# EAGLE schematic Lixieuhr_Master (EAGLE 7.7.0)
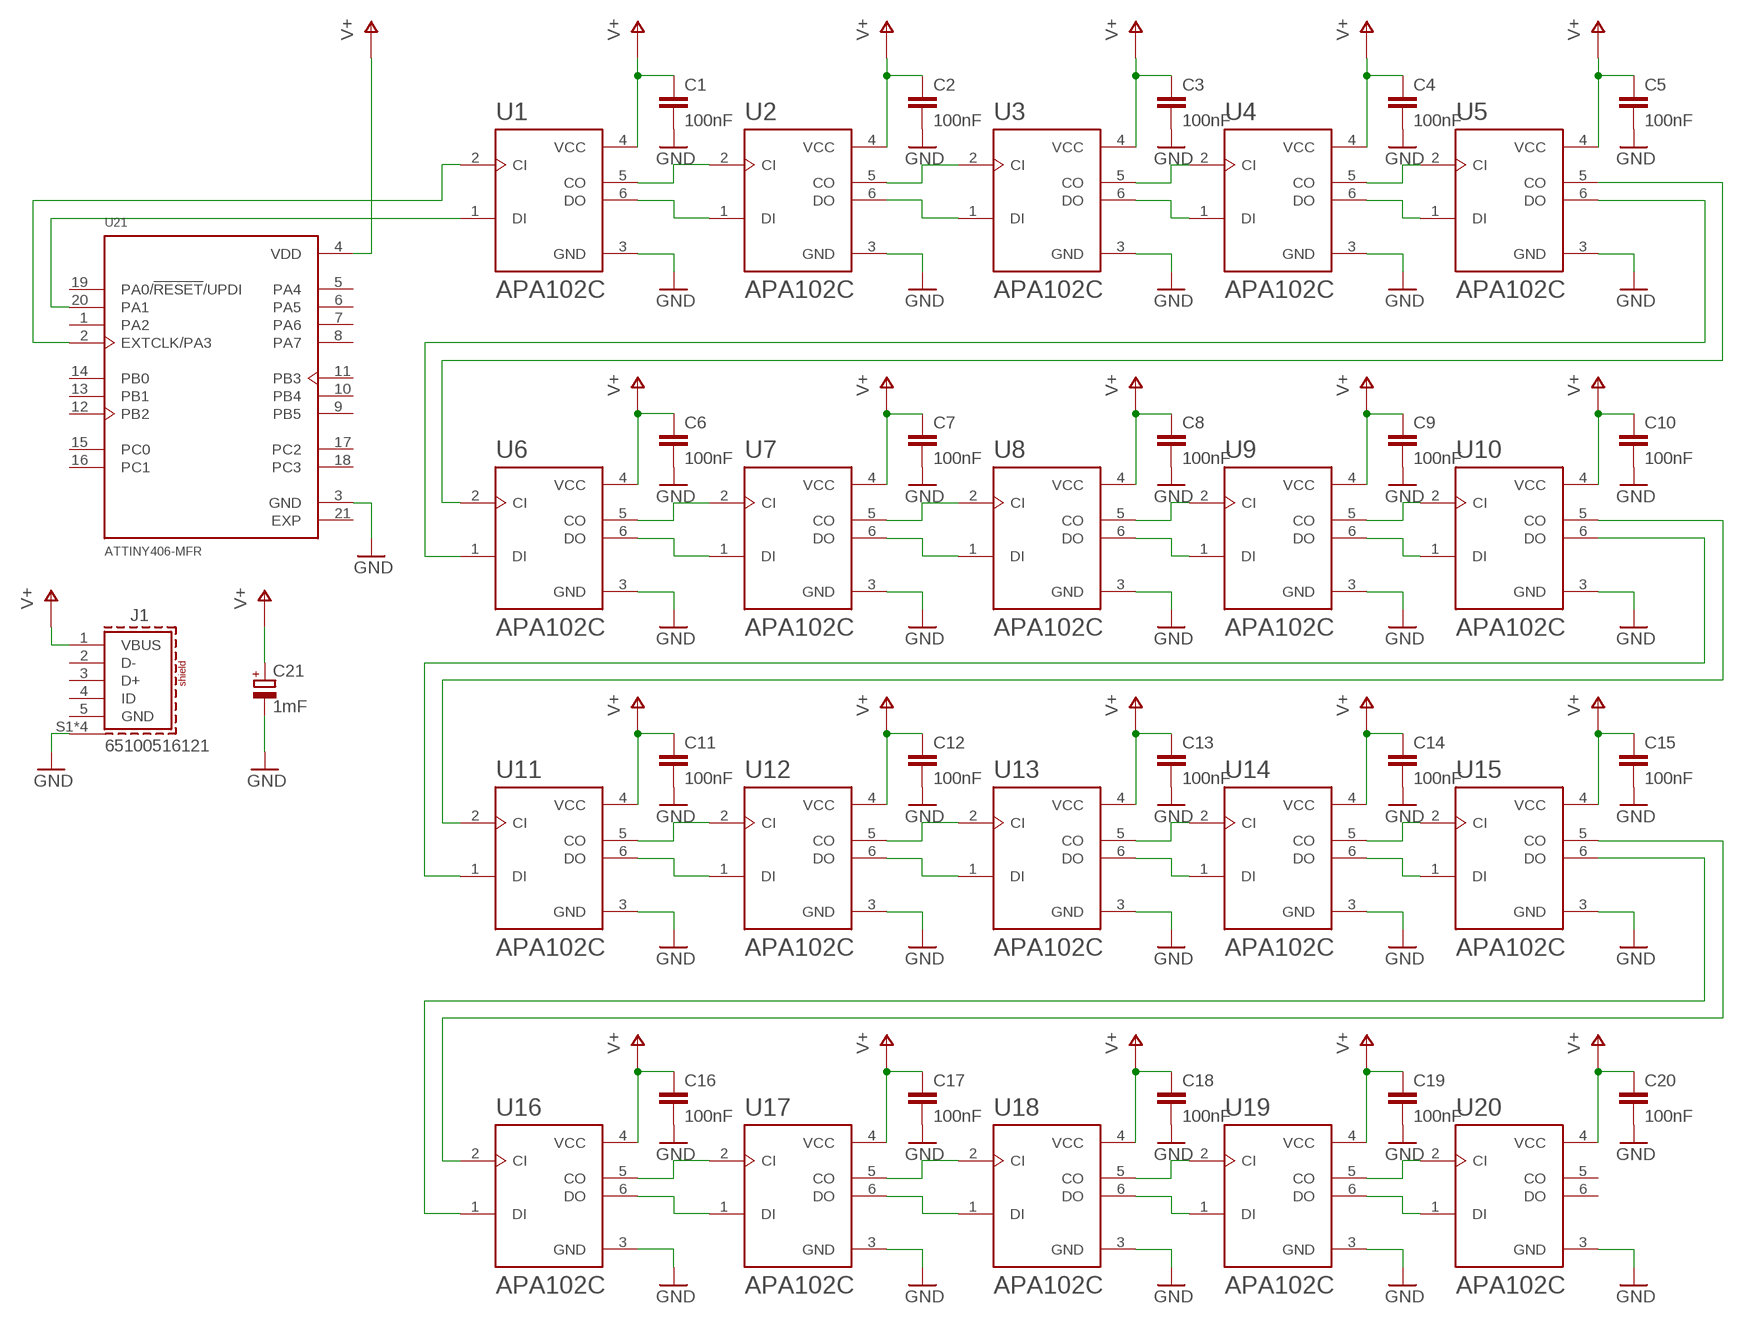
[diagram p0: schematic, sheet 1]

## Parts
C1  100nF  C-0805  [C0805]
C2  100nF  C-0805  [C0805]
C3  100nF  C-0805  [C0805]
C4  100nF  C-0805  [C0805]
C5  100nF  C-0805  [C0805]
C6  100nF  C-0805  [C0805]
C7  100nF  C-0805  [C0805]
C8  100nF  C-0805  [C0805]
C9  100nF  C-0805  [C0805]
C10  100nF  C-0805  [C0805]
C11  100nF  C-0805  [C0805]
C12  100nF  C-0805  [C0805]
C13  100nF  C-0805  [C0805]
C14  100nF  C-0805  [C0805]
C15  100nF  C-0805  [C0805]
C16  100nF  C-0805  [C0805]
C17  100nF  C-0805  [C0805]
C18  100nF  C-0805  [C0805]
C19  100nF  C-0805  [C0805]
C20  100nF  C-0805  [C0805]
C21  1mF  CPOL-EUE5-8.5  [E5-8,5]
J1  65100516121  [65100516121]
U1  APA102C  [SON160P500X500X140-6N]
U2  APA102C  [SON160P500X500X140-6N]
U3  APA102C  [SON160P500X500X140-6N]
U4  APA102C  [SON160P500X500X140-6N]
U5  APA102C  [SON160P500X500X140-6N]
U6  APA102C  [SON160P500X500X140-6N]
U7  APA102C  [SON160P500X500X140-6N]
U8  APA102C  [SON160P500X500X140-6N]
U9  APA102C  [SON160P500X500X140-6N]
U10  APA102C  [SON160P500X500X140-6N]
U11  APA102C  [SON160P500X500X140-6N]
U12  APA102C  [SON160P500X500X140-6N]
U13  APA102C  [SON160P500X500X140-6N]
U14  APA102C  [SON160P500X500X140-6N]
U15  APA102C  [SON160P500X500X140-6N]
U16  APA102C  [SON160P500X500X140-6N]
U17  APA102C  [SON160P500X500X140-6N]
U18  APA102C  [SON160P500X500X140-6N]
U19  APA102C  [SON160P500X500X140-6N]
U20  APA102C  [SON160P500X500X140-6N]
U21  ATTINY406-MFR  [QFN40P300X300X90-21N]

## Nets
GND: C1.2 C2.2 C3.2 C4.2 C5.2 C6.2 C7.2 C8.2 C9.2 C10.2 C11.2 C12.2 C13.2 C14.2 C15.2 C16.2 C17.2 C18.2 C19.2 C20.2 C21.- J1.S1(SHIELD) J1.S2(SHIELD) J1.S3(SHIELD) J1.S4(SHIELD) U1.3(GND) U2.3(GND) U3.3(GND) U4.3(GND) U5.3(GND) U6.3(GND) U7.3(GND) U8.3(GND) U9.3(GND) U10.3(GND) U11.3(GND) U12.3(GND) U13.3(GND) U14.3(GND) U15.3(GND) U16.3(GND) U17.3(GND) U18.3(GND) U19.3(GND) U20.3(GND) U21.3(GND)
N$1: U6.5(CO) U7.2(CI)
N$2: U7.5(CO) U8.2(CI)
N$3: U8.5(CO) U9.2(CI)
N$4: U9.5(CO) U10.2(CI)
N$5: U11.5(CO) U12.2(CI)
N$6: U12.5(CO) U13.2(CI)
N$7: U13.5(CO) U14.2(CI)
N$8: U14.5(CO) U15.2(CI)
N$9: U16.5(CO) U17.2(CI)
N$10: U17.5(CO) U18.2(CI)
N$11: U18.5(CO) U19.2(CI)
N$12: U19.5(CO) U20.2(CI)
N$13: U16.6(DO) U17.1(DI)
N$14: U17.6(DO) U18.1(DI)
N$15: U18.6(DO) U19.1(DI)
N$16: U19.6(DO) U20.1(DI)
N$17: U14.6(DO) U15.1(DI)
N$18: U13.6(DO) U14.1(DI)
N$19: U12.6(DO) U13.1(DI)
N$20: U11.6(DO) U12.1(DI)
N$21: U6.6(DO) U7.1(DI)
N$22: U7.6(DO) U8.1(DI)
N$23: U8.6(DO) U9.1(DI)
N$24: U9.6(DO) U10.1(DI)
N$25: U1.5(CO) U2.2(CI)
N$26: U1.6(DO) U2.1(DI)
N$27: U2.5(CO) U3.2(CI)
N$28: U2.6(DO) U3.1(DI)
N$29: U3.5(CO) U4.2(CI)
N$30: U3.6(DO) U4.1(DI)
N$31: U4.5(CO) U5.2(CI)
N$32: U4.6(DO) U5.1(DI)
N$33: U15.6(DO) U16.1(DI)
N$34: U1.2(CI) U21.2(EXTCLK/PA3)
N$35: U1.1(DI) U21.20(PA1)
N$36: U5.5(CO) U6.2(CI)
N$37: U5.6(DO) U6.1(DI)
N$38: U10.5(CO) U11.2(CI)
N$39: U10.6(DO) U11.1(DI)
N$40: U15.5(CO) U16.2(CI)
V+: C1.1 C2.1 C3.1 C4.1 C5.1 C6.1 C7.1 C8.1 C9.1 C10.1 C11.1 C12.1 C13.1 C14.1 C15.1 C16.1 C17.1 C18.1 C19.1 C20.1 C21.+ J1.1(VBUS) U1.4(VCC) U2.4(VCC) U3.4(VCC) U4.4(VCC) U5.4(VCC) U6.4(VCC) U7.4(VCC) U8.4(VCC) U9.4(VCC) U10.4(VCC) U11.4(VCC) U12.4(VCC) U13.4(VCC) U14.4(VCC) U15.4(VCC) U16.4(VCC) U17.4(VCC) U18.4(VCC) U19.4(VCC) U20.4(VCC) U21.4(VDD)
Unconnected: J1.2(D-) J1.3(D+) J1.4(ID) J1.5(GND) U20.5(CO) U20.6(DO) U21.1(PA2) U21.5(PA4) U21.6(PA5) U21.7(PA6) U21.8(PA7) U21.9(PB5) U21.10(PB4) U21.11(PB3) U21.12(PB2) U21.13(PB1) U21.14(PB0) U21.15(PC0) U21.16(PC1) U21.17(PC2) U21.18(PC3) U21.19(PA0/!RESET!/UPDI)

## Power pins joined to a net without a drawn wire
EXP: U21.21(EXP)

## Library data of the parts
C1-C20 = 0_HTL_MegaCard_V3:C: Capacitor
C21 = 0_HTL_MegaCard_V3:CPOL-EU: POLARIZED CAPACITOR, European symbol
J1 = 65100516121:65100516121: WR-COM Mini USB 2.0 Type B SMT Horizontal 5 Contacts Kind Properties Durability:1 500 Mating cycles Quality Class:1 500 Mating cycles Connector Type:Mini USB Gender:Receptacle Type:Horizontal General Information Operating Temperature:-40up to +105 °C Compliance:RoHS Electrical Properties IR 1:1A Working Voltage:30V (AC) Withstanding Voltage:750V (AC) Contact Resistance:20 mΩ Material Properties Insulator Material:LCP Insulator Flammability Rating:UL94 V-0 Color:Black Cover Material:Brass Cover Plating:Nickel Contact Material:Copper Alloy Contact Plating: Selective Gold Contact Type:Stamped Shielding Material:Brass Shielding Plating:Nickel <https://www.we-online.com/catalog/media/o33005v209%20Family_WR-COM_65100516121.jpg> Details see: https://www.we-online.com/catalog/en/COM_SMT_MINI_TYPE_B_HORIZONTAL/ Updated by Yingchun, Shan 2020-01-16 2020 (C) Würth Elektronik Check availability <https://pricing.snapeda.com/parts/65100516121/W%C3%BCrth%20Elektronik/view-part?ref=eda>; AVAILABILITY: In Stock; DESCRIPTION: USB - mini B USB 2.0 Receptacle Connector 5 Position Surface Mount, Right Angle; MF: Würth Elektronik; MP: 65100516121; PACKAGE: None; PRICE: None; PURCHASE-URL: https://pricing.snapeda.com/search/part/65100516121/?ref=eda
U1-U20 = APA102C:APA102C: RGB Full Color LED control IC Check availability <https://pricing.snapeda.com/parts/APA102C/Shiji%20Lighting/view-part?ref=eda>; AVAILABILITY: Not in stock; DESCRIPTION: Addressable Lighting - 1 LED Discrete Serial Red, Green, Blue (RGB) 5.00mm L x 5.00mm W; MF: Shiji Lighting; MP: APA102C; PACKAGE: SMD-6 Shiji Lightning; PRICE: None
U21 = ATTINY406-MFR:ATTINY406-MFR: ATtiny Series 4 KB Flash 256 B RAM 20 MHz 8-Bit Microcontroller - VQFN-20 Check availability <https://pricing.snapeda.com/parts/ATTINY406-MFR/Microchip/view-part?ref=eda>; AVAILABILITY: In Stock; DESCRIPTION: AVR AVR® ATtiny, Functional Safety (FuSa) Microcontroller IC 8-Bit 20MHz 4KB (4K x 8) FLASH 20-VQFN (3x3); MF: Microchip; MP: ATTINY406-MFR; PACKAGE: VQFN-20 Microchip; PRICE: None; PURCHASE-URL: https://pricing.snapeda.com/search/part/ATTINY406-MFR/?ref=eda